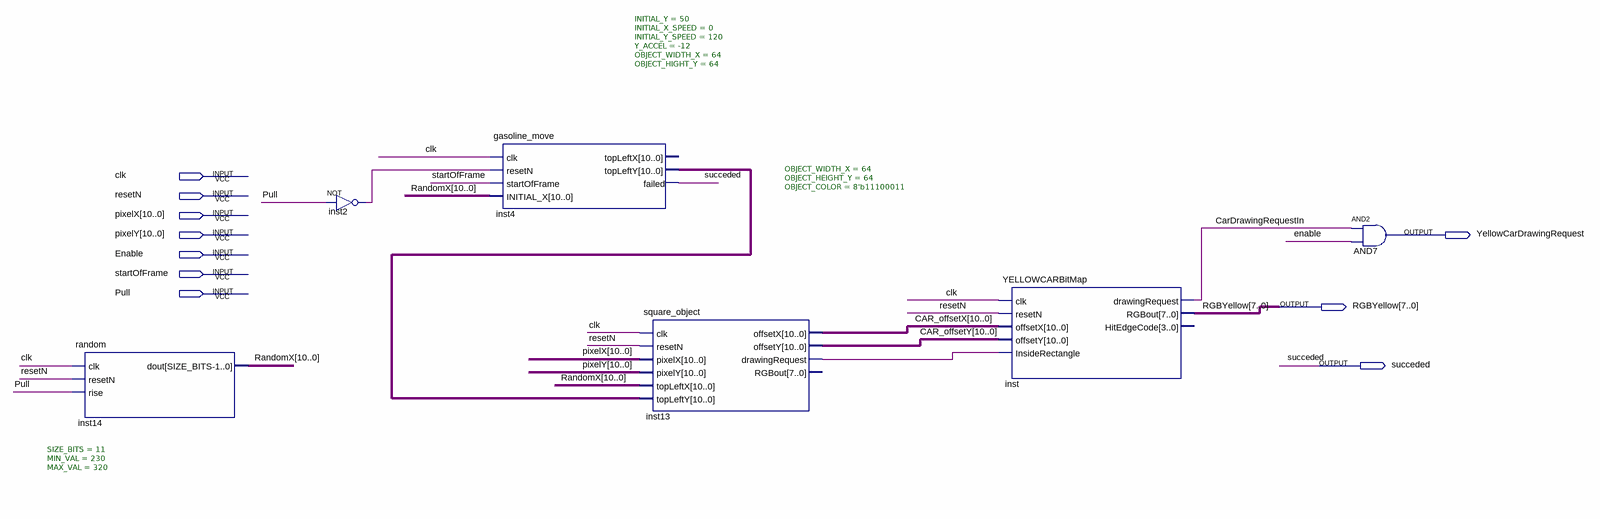
[diagram p0: schematic sheet]
// Quartus schematic YellowCar.bdf as structural Verilog: 6 symbols, 10 pins
module YellowCar (
  input  clk,
  input  resetN,
  input  [10:0] pixelX,
  input  [10:0] pixelY,
  input  Enable,
  input  startOfFrame,
  input  Pull,
  output YellowCarDrawingRequest,
  output [7:0] RGBYellow,
  output succeded
);

  wire CarDrawingRequestIn, inst2_out, inst13_drawingrequest;
  wire [10:0] CAR_offsetX, CAR_offsetY, inst4_toplefty, RandomX;

  random #(.SIZE_BITS(11), .MIN_VAL(230), .MAX_VAL(320)) inst14 (
    .clk(clk), .resetN(resetN), .rise(Pull), .dout(RandomX));
  not inst2 (inst2_out, Pull);
  gasoline_move #(.INITIAL_Y(50), .INITIAL_X_SPEED(0), .INITIAL_Y_SPEED(120), .Y_ACCEL(-12), .OBJECT_WIDTH_X(64), .OBJECT_HIGHT_Y(64)) inst4 (
    .clk(clk), .resetN(inst2_out), .startOfFrame(startOfFrame), .INITIAL_X(RandomX),
    .topLeftY(inst4_toplefty), .failed(succeded));  // open: topLeftX
  square_object #(.OBJECT_WIDTH_X(64), .OBJECT_HEIGHT_Y(64), .OBJECT_COLOR(8'b11100011)) inst13 (
    .clk(clk), .resetN(resetN), .pixelX(pixelX), .pixelY(pixelY), .topLeftX(RandomX),
    .topLeftY(inst4_toplefty), .offsetX(CAR_offsetX), .offsetY(CAR_offsetY),
    .drawingRequest(inst13_drawingrequest));  // open: RGBout
  YELLOWCARBitMap inst (
    .clk(clk), .resetN(resetN), .offsetX(CAR_offsetX), .offsetY(CAR_offsetY),
    .InsideRectangle(inst13_drawingrequest), .drawingRequest(CarDrawingRequestIn), .RGBout(RGBYellow));  // open: HitEdgeCode
  and AND7 (YellowCarDrawingRequest, CarDrawingRequestIn, Enable);
endmodule
